# EAGLE design RHD2132_lvds_headstage_neuroengenharia_v3 (EAGLE 8.3.1)
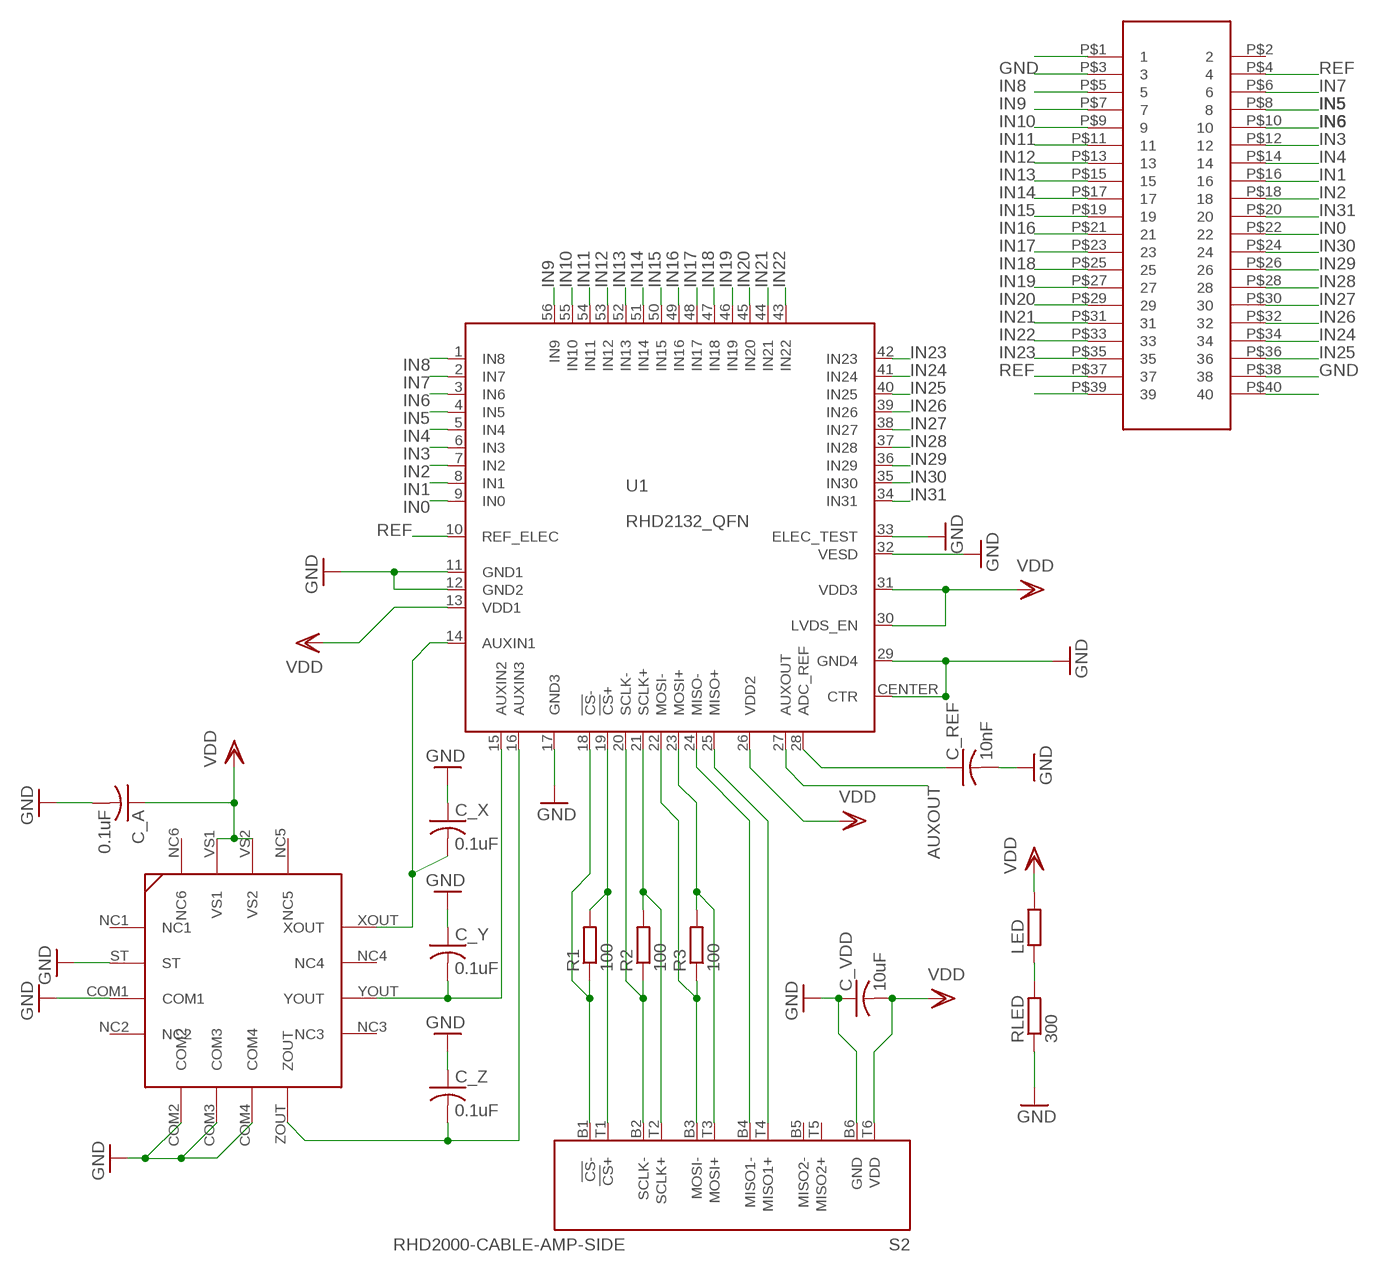
[diagram p0: schematic, sheet 1]

## Parts
C_A  0.1uF  C-USC0402K  [C0402K]
C_REF  10nF  C-USC0402K  [C0402K]
C_VDD  10uF  C-USC0402K  [C0402K]
C_X  0.1uF  C-USC0402K  [C0402K]
C_Y  0.1uF  C-USC0402K  [C0402K]
C_Z  0.1uF  C-USC0402K  [C0402K]
LED  R-EU_R0402  [R0402]
R1  100  R-EU_R0402  [R0402]
R2  100  R-EU_R0402  [R0402]
R3  100  R-EU_R0402  [R0402]
RLED  300  R-EU_R0402  [R0402]
S2  RHD2000-CABLE-AMP-SIDE  [OMNETICS_PZN-12-AA]
U1  RHD2132_QFN  [QFN56_8_X_8_LARGE]
U$1  ADXL335  [ADXL335]
U$2  MOLEX_552010478  [MOLEX]

## Nets
ADC_REF: C_REF.1 U1.28(ADC_REF)
AUXOUT: U1.27(AUXOUT)
CS+: R1.2 S2.T1(!CS!+) U1.19(!CS!+)
CS-: R1.1 S2.B1(!CS!-) U1.18(!CS!-)
GND: C_A.2 C_REF.2 C_VDD.1 C_X.1 C_Y.1 C_Z.1 RLED.1 S2.B6(GND) U1.11(GND1) U1.12(GND2) U1.17(GND3) U1.29(GND4) U1.32(VESD) U1.33(ELEC_TEST) U1.CENTER(CTR) U$1.COM1 U$1.COM2 U$1.COM3 U$1.COM4 U$1.ST U$2.P$3 U$2.P$38
IN0: U1.9(IN0) U$2.P$22
IN1: U1.8(IN1) U$2.P$16
IN2: U1.7(IN2) U$2.P$18
IN3: U1.6(IN3) U$2.P$12
IN4: U1.5(IN4) U$2.P$14
IN5: U1.4(IN5) U$2.P$8
IN6: U1.3(IN6) U$2.P$10
IN7: U1.2(IN7) U$2.P$6
IN8: U1.1(IN8) U$2.P$5
IN9: U1.56(IN9) U$2.P$7
IN10: U1.55(IN10) U$2.P$9
IN11: U1.54(IN11) U$2.P$11
IN12: U1.53(IN12) U$2.P$13
IN13: U1.52(IN13) U$2.P$15
IN14: U1.51(IN14) U$2.P$17
IN15: U1.50(IN15) U$2.P$19
IN16: U1.49(IN16) U$2.P$21
IN17: U1.48(IN17) U$2.P$23
IN18: U1.47(IN18) U$2.P$25
IN19: U1.46(IN19) U$2.P$27
IN20: U1.45(IN20) U$2.P$29
IN21: U1.44(IN21) U$2.P$31
IN22: U1.43(IN22) U$2.P$33
IN23: U1.42(IN23) U$2.P$35
IN24: U1.41(IN24) U$2.P$34
IN25: U1.40(IN25) U$2.P$36
IN26: U1.39(IN26) U$2.P$32
IN27: U1.38(IN27) U$2.P$30
IN28: U1.37(IN28) U$2.P$28
IN29: U1.36(IN29) U$2.P$26
IN30: U1.35(IN30) U$2.P$24
IN31: U1.34(IN31) U$2.P$20
LEDOUT: LED.1 RLED.2
MISO1+: S2.T4(MISO1+) U1.25(MISO+)
MISO1-: S2.B4(MISO1-) U1.24(MISO-)
MOSI+: R3.2 S2.T3(MOSI+) U1.23(MOSI+)
MOSI-: R3.1 S2.B3(MOSI-) U1.22(MOSI-)
N$2: U$2.P$1
N$21: U$2.P$39
N$22: U$2.P$40
REF: U1.10(REF_ELEC) U$2.P$4 U$2.P$37
SCLK+: R2.2 S2.T2(SCLK+) U1.21(SCLK+)
SCLK-: R2.1 S2.B2(SCLK-) U1.20(SCLK-)
VDD: C_A.1 C_VDD.2 LED.2 S2.T6(VDD) U1.13(VDD1) U1.26(VDD2) U1.30(LVDS_EN) U1.31(VDD3) U$1.VS1 U$1.VS2
XOUT: C_X.2 U1.14(AUXIN1) U$1.XOUT
YOUT: C_Y.2 U1.15(AUXIN2) U$1.YOUT
ZOUT: C_Z.2 U1.16(AUXIN3) U$1.ZOUT
Unconnected: S2.B5(MISO2-) S2.T5(MISO2+) U$1.NC1 U$1.NC2 U$1.NC3 U$1.NC4 U$1.NC5 U$1.NC6 U$2.P$2

## Library data of the parts
C_A C_REF C_VDD C_X C_Y C_Z = resistor:C-US: CAPACITOR, American symbol
LED R1-R3 RLED = resistor:R-EU_: RESISTOR, European symbol
S2 = RHD2000:RHD2000-CABLE-AMP-SIDE
U1 = RHD2000:RHD2132
U$1 = voigts:ADXL335: The ADXL335 is a small, thin, low power, complete 3-axis accelerometer with signal conditioned voltage outputs. The product measures acceleration with a minimum full-scale range of ±3 g. It can measure the static acceleration of gravity in tilt-sensing applications, as well as dynamic acceleration resulting from motion, shock, or vibration. The user selects the bandwidth of the accelerometer using the CX, CY, and CZ capacitors at the XOUT, YOUT, and ZOUT pins. Bandwidths can be selected to suit the application, with a range of 0.5 Hz to 1600 Hz for the X and Y axes, and a range of 0.5 Hz to 550 Hz for the Z axi
U$2 = george:MOLEX_552010478

## Board
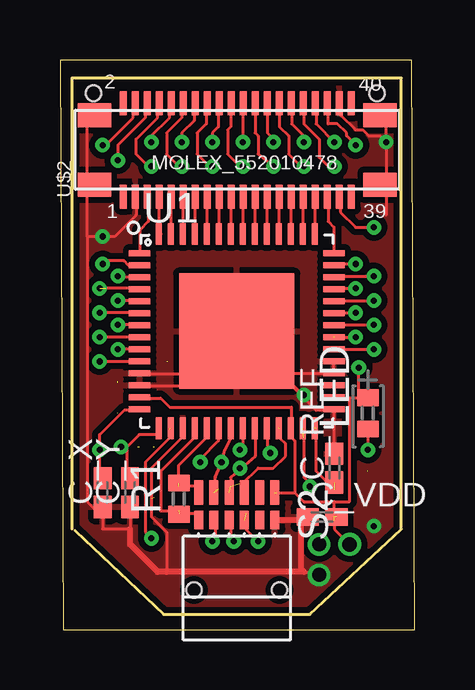
[diagram p1: board, top side]
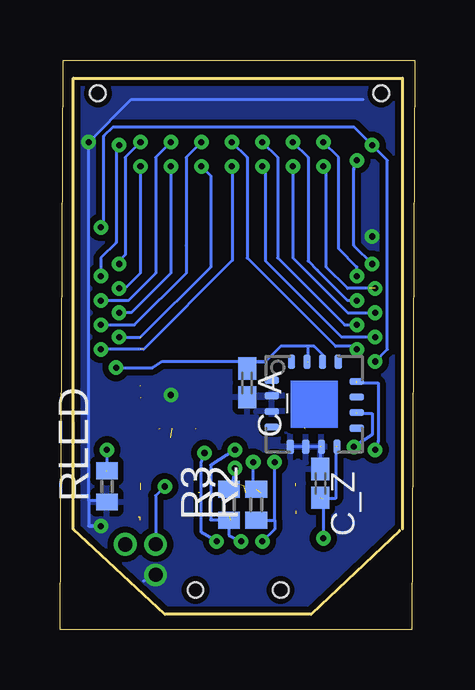
[diagram p2: board, bottom side, seen from below]

Size 14.78 x 23.74 mm. Coordinates in mm from the lower left corner, seen from the top.
Outline: 0.63,4.13 4.32,0.63 10.41,0.63 14.22,4.19 14.22,22.99 0.51,22.99 0.51,4.19
Outline: 0.13,0 14.78,0 14.66,23.74 0,23.74 0.13,0
Copper layers (1*16): Top 0.0178mm / dielectric 59mil / Bottom 0.0178mm
Design rules "default": minimum track width 5mil, minimum drill 10mil, track to track 5mil, track to pad 5mil, pad to pad 5mil, via to via 5mil, smd to smd 5mil, copper to edge 10mil, drill to drill 16mil, minimum pad ring 8mil, minimum via ring 7mil, stop-mask expansion 3mil, vias tented up to drill 0mil, thermal gap 10mil
Holes 0.64 mm at 1.4,22.35 13.21,22.35 5.59,1.65 9.14,1.65

### Footprints (pad centres in the part's own frame; a part is rotated, then mirrored left to right if it is on the bottom)
C0402K = smd 0.925 x 0.74: 1 -0.6,0; 2 0.6,0
R0402 = smd 0.7 x 0.9: 1 -0.65,0; 2 0.65,0
OMNETICS_PZN-12-AA = smd 0.381 x 0.762: B1 1.587,-1.016; B2 0.953,-1.016; B3 0.318,-1.016; B4 -0.318,-1.016; B5 -0.953,-1.016; B6 -1.587,-1.016 | smd 0.381 x 1.016: T1 1.587,-2.159; T2 0.953,-2.159; T3 0.318,-2.159; T4 -0.318,-2.159; T5 -0.953,-2.159; T6 -1.587,-2.159
QFN56_8_X_8_LARGE = smd 0.9 x 0.25: 1 -4.05,3.25; 2 -4.05,2.75; 3 -4.05,2.25; 4 -4.05,1.75; 5 -4.05,1.25; 6 -4.05,0.75; 7 -4.05,0.25; 8 -4.05,-0.25; 9 -4.05,-0.75; 10 -4.05,-1.25; 11 -4.05,-1.75; 12 -4.05,-2.25; 13 -4.05,-2.75; 14 -4.05,-3.25; 29 4.05,-3.25; 30 4.05,-2.75; 31 4.05,-2.25; 32 4.05,-1.75; 33 4.05,-1.25; 34 4.05,-0.75; 35 4.05,-0.25; 36 4.05,0.25; 37 4.05,0.75; 38 4.05,1.25; 39 4.05,1.75; 40 4.05,2.25; 41 4.05,2.75; 42 4.05,3.25 | smd 0.25 x 0.9: 15 -3.25,-4.05; 16 -2.75,-4.05; 17 -2.25,-4.05; 18 -1.75,-4.05; 19 -1.25,-4.05; 20 -0.75,-4.05; 21 -0.25,-4.05; 22 0.25,-4.05; 23 0.75,-4.05; 24 1.25,-4.05; 25 1.75,-4.05; 26 2.25,-4.05; 27 2.75,-4.05; 28 3.25,-4.05; 43 3.25,4.05; 44 2.75,4.05; 45 2.25,4.05; 46 1.75,4.05; 47 1.25,4.05; 48 0.75,4.05; 49 0.25,4.05; 50 -0.25,4.05; 51 -0.75,4.05; 52 -1.25,4.05; 53 -1.75,4.05; 54 -2.25,4.05; 55 -2.75,4.05; 56 -3.25,4.05 | smd 4.8 x 4.8: CENTER 0,0
ADXL335 = smd 0.61 x 0.305: COM1 -1.775,-0.3; NC1 -1.775,1; NC2 -1.775,-0.95; NC3 1.775,-1; NC4 1.775,0.3; ST -1.775,0.35; XOUT 1.775,0.95; YOUT 1.775,-0.35 | smd 0.305 x 0.61: COM2 -1,-1.775; COM3 -0.35,-1.775; COM4 0.3,-1.775; NC5 1,1.775; NC6 -0.95,1.775; VS1 0.35,1.775; VS2 -0.3,1.775; ZOUT 0.95,-1.775
MOLEX = smd 0.3 x 1: P$1 0.1,-2.4; P$2 0.1,1.5; P$3 0.6,-2.4; P$4 0.6,1.5; P$5 1.1,-2.4; P$6 1.1,1.5; P$7 1.6,-2.4; P$8 1.6,1.5; P$9 2.1,-2.4; P$10 2.1,1.5; P$11 2.6,-2.4; P$12 2.6,1.5; P$13 3.1,-2.4; P$14 3.1,1.5; P$15 3.6,-2.4; P$16 3.6,1.5; P$17 4.1,-2.4; P$18 4.1,1.5; P$19 4.6,-2.4; P$20 4.6,1.5; P$21 5.1,-2.4; P$22 5.1,1.5; P$23 5.6,-2.4; P$24 5.6,1.5; P$25 6.1,-2.4; P$26 6.1,1.5; P$27 6.6,-2.4; P$28 6.6,1.5; P$29 7.1,-2.4; P$30 7.1,1.5; P$31 7.6,-2.4; P$32 7.6,1.5; P$33 8.1,-2.4; P$34 8.1,1.5; P$35 8.6,-2.4; P$36 8.6,1.5; P$37 9.1,-2.4; P$38 9.1,1.5; P$39 9.6,-2.4; P$40 9.6,1.5 | smd 1.4 x 1: P$41 -1.1,1; P$42 -1.1,-1.9; P$43 10.8,-1.9; P$44 10.8,1

### Placement (x,y rotation side)
C_A  6.99,10.29 270 bottom
C_REF  11.43,6.73 90 top
C_VDD  10.92,4.7 0 top
C_X  1.78,5.72 90 top
C_Y  2.92,5.72 90 top
C_Z  3.94,6.1 270 bottom
LED  12.83,9.02 90 top
R1  4.95,5.46 90 top
R2  6.6,5.21 90 bottom
R3  7.75,5.21 90 bottom
RLED  12.83,5.97 90 bottom
S2  7.37,3.56 180 top
U1  7.37,12.45 0 top
U$1  4.19,9.4 0 bottom
U$2  2.54,20.45 0 top

### Tracks (layer width: path | path; a pad name or v marks a point on that pad's centre or on a via)
ADC_REF  (2 unrouted)
  Top 0.127: 11.43,5.84 10.67,6.6 10.67,8.38
AUXOUT  (via drill 0.25, 0.58)  (1 unrouted)
  Top 0.127: 10.16,8 10.16,6.35 10.41,6.1 v10.41,5.97
  Bottom 0.127: v10.41,5.97 10.79,5.59 v10.79,3.56
CS+  (1 unrouted)
  Top 0.127: U1.19 6.1,8.38 6.1,8 4.95,6.86 4.95,5.97 5.72,5.97 5.72,5.78 S2.T1
CS-  (1 unrouted)
  Top 0.127: 4.95,4.95 4.19,4.95 4.19,6.6 5.59,8 5.59,8.37 U1.18 | R1.1 4.97,4.83 5.72,4.83 5.72,4.64 S2.B1
GND  (via drill 0.25, 0.58)  (1 unrouted)
  Top 0.127: 11.43,7.62 11.43,9.14 10.67,9.14 9.27,10.54 | 4.45,2.41 4.45,4.06 3.81,4.7 3.81,6.73 5.08,8 5.08,8.36 U1.17 | 1.78,4.7 1.14,5.33 1.14,16.37 | 1.78,4.7 1.78,4.19 2.92,4.19 2.92,5.33 | 5.59,10.67 3.3,10.67 3.3,10.68 U1.11 | 5.59,10.67 5.84,10.67 5.33,10.16 3.3,10.16 3.3,10.18 U1.12 | 6.22,11.12 6.32,11.19 | 6.22,11.12 5.59,10.67 | 6.47,11.3 6.32,11.19 | 6.47,11.3 7.37,11.94 | 11.43,10.67 9.4,10.67 9.27,10.54 | 10.03,2.54 10.16,2.38 10.71,2.38 v10.79,2.29 | 1.14,16.37 1.14,21.46 | 1.14,16.37 1.76,16.37 v1.78,16.38 2.29,16.38 3.18,17.27 3.18,18.01 U$2.P$3 | v13.59,20.32 13.33,20.57 12.87,20.57 12.62,20.83 12.32,20.83 11.68,21.46 11.68,21.9 U$2.P$38 | U1.32 U1.33 | 9.27,10.54 U1.CENTER | U1.CENTER 6.47,11.55 6.47,11.3 | U1.CENTER 6.32,11.4 6.32,11.19 | v13.59,20.32 13.59,21.46 | v13.59,20.32 13.59,17.27 | U1.CENTER 6.22,11.3 6.22,11.12 | C_X.1 1.78,4.7 | U1.CENTER v10.16,9.78 | C_VDD.1 10.2,4.57 10.03,4.57
  Top 0.254: 9.02,4.57 10.03,4.57 10.03,2.54 10.16,2.41 4.45,2.41 4.06,2.41 2.92,3.56 2.92,4.19
  Bottom 0.127: 5.08,7.62 3.94,7.62 3.94,6.73 | 2.16,22.1 11.81,22.1 v13.59,20.32 13.59,5.38 | 13.59,5.38 13.59,4.32 13.57,4.33 | 11.3,2.03 v10.79,2.29 | 13.57,4.33 13.1,4.33 v13.08,4.32 13.56,4.32 13.57,4.33 | RLED.1 12.89,5.38 13.59,5.38
  pour Top (isolate 0.254): 0.13,23.37 0.13,4 4.19,0.38 10.41,0.25 14.6,4.19 14.73,23.37
  pour Bottom (isolate 0.254): 0.76,23.75 0.25,4.13 3.56,0.25 11.43,0.51 13.97,4.19 14.48,23.24
IN0  (via drill 0.25)
  Top 0.127: U$2.P$22 7.62,21.93 v7.62,20.32 | U1.9 3.3,11.68 v2.41,11.68
  Bottom 0.127: v2.41,11.68 2.54,11.81 3.3,11.81 6.99,15.49 6.99,19.69 v7.62,20.32
IN1  (via drill 0.25)
  Top 0.127: U$2.P$16 6.1,21.9 6.1,21.08 5.72,20.7 5.72,19.81 6.22,19.3 v6.35,19.3 | U1.8 v1.65,12.19
  Bottom 0.127: v1.65,12.19 3.05,12.19 6.22,15.37 6.22,19.18 v6.35,19.3
IN2  (via drill 0.25)
  Top 0.127: U$2.P$18 6.6,21.91 6.6,20.96 6.35,20.7 v6.35,20.32 | U1.7 v2.41,12.7
  Bottom 0.127: v2.41,12.7 2.92,12.7 5.72,15.49 5.72,19.69 v6.35,20.32
IN3  (via drill 0.25)
  Top 0.127: U$2.P$12 5.08,21.89 5.08,21.34 4.45,20.7 4.45,19.81 4.95,19.3 v5.08,19.3 | U1.6 3.3,13.21 v1.65,13.21
  Bottom 0.127: v1.65,13.21 2.79,13.21 5.08,15.49 v5.08,19.3
IN4  (via drill 0.25)
  Top 0.127: 5.59,21.89 U$2.P$14 5.59,21.89 | v5.08,20.32 5.08,20.7 5.59,21.21 5.59,21.89 | U1.5 3.3,13.72 v2.41,13.72
  Bottom 0.127: v2.41,13.72 2.79,13.72 4.06,14.98 | 4.06,14.98 4.06,14.99 | v5.08,20.32 4.45,19.69 4.45,15.37 4.06,14.98
IN5  (via drill 0.25)  (1 unrouted)
  Top 0.127: 4.19,21.95 U$2.P$8 4.06,21.87 4.06,21.34 3.18,20.45 3.18,19.81 3.68,19.3 v3.81,19.3 | U1.4 3.29,14.22 v1.65,14.22
  Bottom 0.127: 1.91,14.22 2.79,14.22 3.68,15.11 3.68,19.18 v3.81,19.3
IN6  (via drill 0.25)
  Top 0.127: U$2.P$10 4.57,21.88 4.57,21.34 3.81,20.57 v3.81,20.32 | U1.3 2.45,14.7 v2.41,14.73
  Bottom 0.127: v2.41,14.73 2.41,15.11 3.18,15.88 3.18,19.69 v3.81,20.32
IN7  (via drill 0.25)
  Top 0.127: 3.67,21.95 U$2.P$6 | 3.67,21.95 3.68,21.95 | 3.67,21.95 3.56,21.83 3.56,21.34 2.41,20.19 v2.41,19.56 | U1.2 2.84,15.2 2.67,15.37 1.91,15.37 v1.78,15.24
  Bottom 0.127: v1.78,15.24 2.54,16 2.54,19.18 v2.41,19.56
IN8
  Top 0.127: 3.68,18.05 U$2.P$5 3.68,18 3.68,17.02 3.32,16.65 U1.1
IN9
  Top 0.127: 4.14,16.5 U$2.P$7
  Top 0.254: U1.56 4.14,16.5
IN10
  Top 0.127: U1.55 4.64,16.5 U$2.P$9
IN11
  Top 0.127: U1.54 5.14,16.5 U$2.P$11
IN12
  Top 0.127: U1.53 5.64,16.5 U$2.P$13
IN13
  Top 0.127: U1.52 6.14,16.5 U$2.P$15
IN14
  Top 0.127: U1.51 6.64,16.5 U$2.P$17
IN15
  Top 0.127: U1.50 7.14,16.5 U$2.P$19
IN16
  Top 0.127: U1.49 7.64,16.5 U$2.P$21
IN17
  Top 0.127: U1.48 8.14,16.5 U$2.P$23
IN18
  Top 0.127: U1.47 8.64,16.5 U$2.P$25
IN19
  Top 0.127: U1.46 9.14,16.5 U$2.P$27
IN20
  Top 0.127: U1.45 9.64,16.5 U$2.P$29
IN21
  Top 0.127: U1.44 10.14,16.5 U$2.P$31
IN22
  Top 0.127: U1.43 10.64,16.5 U$2.P$33
IN23
  Top 0.127: 11.18,18.05 U$2.P$35 11.18,18.01 11.18,17.02 11.42,16.78 U1.42
IN24  (via drill 0.25)
  Top 0.127: U$2.P$34 10.67,21.92 10.67,21.08 v11.43,20.32 | U1.41 11.46,15.24 v12.32,15.24
  Bottom 0.127: v11.43,20.32 12.06,19.69 12.06,15.62 12.32,15.37 v12.32,15.24
IN25  (via drill 0.25)
  Top 0.127: U$2.P$36 11.18,21.91 11.18,21.08 11.56,21.08 11.94,20.7 11.94,20.57 v12.32,20.19 | U1.40 11.45,14.73 v13.08,14.73
  Bottom 0.127: v13.08,14.73 13.08,15.49 12.45,16.13 12.45,20.19 v12.32,20.19
IN26  (via drill 0.25)
  Top 0.127: U$2.P$32 10.16,21.93 10.16,21.08 10.79,20.45 10.79,19.69 11.18,19.3 v11.43,19.3 | U1.39 11.44,14.22 v12.32,14.22
  Bottom 0.127: v12.32,14.22 12.06,14.22 11.43,14.86 v11.43,19.3
IN27  (via drill 0.25)
  Top 0.127: U$2.P$30 9.65,21.94 9.65,21.08 10.16,20.57 v10.16,20.32 | U1.38 11.44,13.72 v13.08,13.72
  Bottom 0.127: v13.08,13.72 11.94,13.72 10.79,14.86 10.79,19.69 v10.16,20.32
IN28  (via drill 0.25)
  Top 0.127: U$2.P$28 9.14,20.96 9.53,20.57 9.53,19.81 10.03,19.3 v10.16,19.3 | U1.37 11.43,13.21 v12.32,13.21
  Bottom 0.127: v12.32,13.21 11.81,13.21 10.16,14.86 10.16,15.62 v10.16,19.3
IN29  (via drill 0.25)
  Top 0.127: U$2.P$26 8.64,20.7 8.89,20.45 v8.89,20.32 | U1.36 v13.08,12.7
  Bottom 0.127: v13.08,12.7 11.68,12.7 9.52,14.86 9.52,16 9.53,16 9.53,19.69 v8.89,20.32
IN30  (via drill 0.25)  (1 unrouted)
  Top 0.127: 11.68,12.19 v12.32,12.19 | U$2.P$24 8.13,20.7 8.26,20.57 8.26,19.81 v8.89,19.3
  Bottom 0.127: v12.32,12.19 11.43,12.19 8.51,15.11 8.51,18.92 v8.89,19.3
IN31  (via drill 0.25)  (1 unrouted)
  Top 0.127: 11.68,11.68 v13.08,11.68 | U$2.P$20 7.11,21.92 7.11,20.96 6.99,20.83 6.99,19.81 7.49,19.3 v7.62,19.3
  Bottom 0.127: v13.08,11.68 11.3,11.68 7.6,15.39 7.6,19.29 v7.62,19.3
LEDOUT  (via drill 0.25)  (1 unrouted)
  Top 0.127: LED.1 v12.83,7.49
  Bottom 0.127: v12.83,7.49 12.83,6.6
MISO1+  (1 unrouted)
  Top 0.127: 9.14,8.38 9.14,8 9.4,7.75 9.4,7.24 8.89,6.73 8.26,6.73 7.62,6.1 7.62,5.78 S2.T4
MISO1-  (via drill 0.25)  (1 unrouted)
  Top 0.127: v8.76,7.37 8.64,7.49 8.64,8.38 U1.24 | 7.75,4.83 7.75,4.19 v8.26,3.68
  Bottom 0.127: v8.26,3.68 8.89,4.06 8.89,6.99 8.76,7.24 v8.76,7.37
MOSI+  (via drill 0.25)  (2 unrouted)
  Top 0.127: 7.11,5.97 7.11,6.35 8.13,7.24 8.13,8.38 U1.23
  Bottom 0.127: 7.51,6.63 7.58,6.22 | 7.51,6.63 7.5,6.72 | 7.58,6.22 7.62,5.97 | 7.5,6.72 v7.49,6.73 7.51,6.72 7.51,6.63 | 7.5,6.72 7.5,6.11 R3.2 7.58,6.02 7.58,6.22
MOSI-  (via drill 0.25)
  Top 0.127: v7.49,7.49 7.62,7.62 U1.22 | v7.24,3.68 7.24,3.81 7.11,3.94 7.11,4.57 S2.B3
  Bottom 0.127: v7.49,7.49 8.51,6.86 8.51,4.57 7.75,4.57 | v7.24,3.68 7.75,3.94 7.75,4.57 | R3.1 7.75,4.57
REF  (via drill 0.25)
  Top 0.127: v1.65,11.18 3.3,11.18 U1.10 | v1.78,20.19 1.91,20.19 3.05,21.34 3.05,21.86 U$2.P$4 | U$2.P$37 11.68,18 11.68,17.4 12.32,16.76 v13.08,16.76
  Bottom 0.127: v13.08,16.76 12.95,16.89 12.95,20.57 12.57,20.96 2.54,20.96 v1.78,20.19 | v1.78,20.19 | 1.77,20.18 v1.78,20.19 | v1.65,11.18 1.14,11.68 1.14,19.56 v1.78,20.19
SCLK+  (via drill 0.25)  (1 unrouted)
  Top 0.127: 6.48,6.22 6.48,6.35 v6.73,6.99 6.86,7.49 7.11,8 U1.21
  Bottom 0.127: v6.73,6.99 6.73,5.97 6.73,5.84 6.62,5.84 R2.2
SCLK-  (via drill 0.25)
  Top 0.127: v5.84,6.99 5.84,7.11 6.6,7.87 6.6,8.38 U1.20 | 6.48,4.57 6.48,4.83 | 6.48,4.56 6.48,4.57 | 6.48,4.56 6.48,3.81 v6.35,3.68 | 6.48,4.57 S2.B2 6.43,4.56 6.48,4.56
  Bottom 0.127: v6.35,3.68 5.84,4.19 5.84,4.57 | 5.84,4.57 v5.84,6.99 | R2.1 6.59,4.57 5.84,4.57
VDD  (via drill 0.25, 0.6)  (6 unrouted)
  Top 0.127: 12.06,9.65 11.43,9.65 11.43,10.16 | 9.02,5.72 9.78,5.72 | 9.78,5.72 9.78,7.87 9.65,8 9.65,8.36 | 9.78,5.72 10.16,5.33 11.43,5.33 | 11.43,4.7 11.43,5.33 | 11.43,5.33 12.06,5.33 12.06,9.65 | 9.65,8.36 9.65,9.27 4.57,9.27 4.19,9.65 3.3,9.65 3.3,9.68 U1.13 | 12.45,9.65 12.06,9.65 | 12.45,9.65 v12.45,10.92 | 11.43,4.57 11.43,4.19 v12.06,3.56 | LED.2 12.81,9.65 12.45,9.65 | U1.26 9.65,8.36
  Bottom 0.127: 4.45,11.18 4.45,11.81 | 4.45,11.81 5.59,11.81 6.22,11.18 10.54,11.18 10.92,10.92 v12.45,10.92 | 4.45,11.81 4.19,11.81 3.81,11.43 3.81,11.2 U$1.VS1
  Bottom 0.152: 6.22,11.18 6.7,11.18 C_A.1
XOUT  (via drill 0.25)  (1 unrouted)
  Top 0.127: 3.3,9.14 3.68,9.14 | 3.3,9.14 2.67,9.14 1.65,8.13 v1.65,7.49 1.65,6.44 C_X.2 | U1.14 3.3,9.18 3.3,9.14
  Bottom 0.127: 2.41,10.29 1.52,10.29 1.52,7.87 v1.65,7.49
YOUT  (via drill 0.25)  (1 unrouted)
  Top 0.127: 2.79,7.62 3.3,8.13 4.06,8.13 4.06,8.34 U1.15 | v2.54,7.62 2.79,7.62 | C_Y.2 2.79,6.44 2.79,7.62
  Bottom 0.127: 2.41,9.02 1.78,9.02 1.78,8.13 v2.54,7.62
ZOUT  (via drill 0.25)  (3 unrouted)
  Top 0.127: v3.81,3.81 3.56,4.06 3.56,6.99 4.57,8 4.57,8.38
  Bottom 0.127: 3.3,7.62 3.3,5.46 3.81,5.46 v3.81,3.81 3.81,5.33

### Text on the board
bDocu: 32ch headstage | rev 2.0 omnetics | dec 2012 | open-ephys.org | powered by | intan | C_A | adxl335 | C_z | r100 | r_led | r100